# Altium project Cells_in_Space.PrjPcb (part 2 of 2)

## Sheet Valve.SchDoc
size A4; SheetNumber: 6; SheetTotal: 7
Used 16 times, as channels Designator/Valve1, Designator/Valve2, Designator/Valve3, Designator/Valve4, Designator/Valve5, Designator/Valve6, Designator/Valve7, Designator/Valve8, Designator/Valve9, Designator/Valve10, Designator/Valve11, Designator/Valve12, Designator/Valve13, Designator/Valve14, Designator/Valve15, Designator/Valve16. Parts and nets are listed once, with the designators drawn on the sheet.
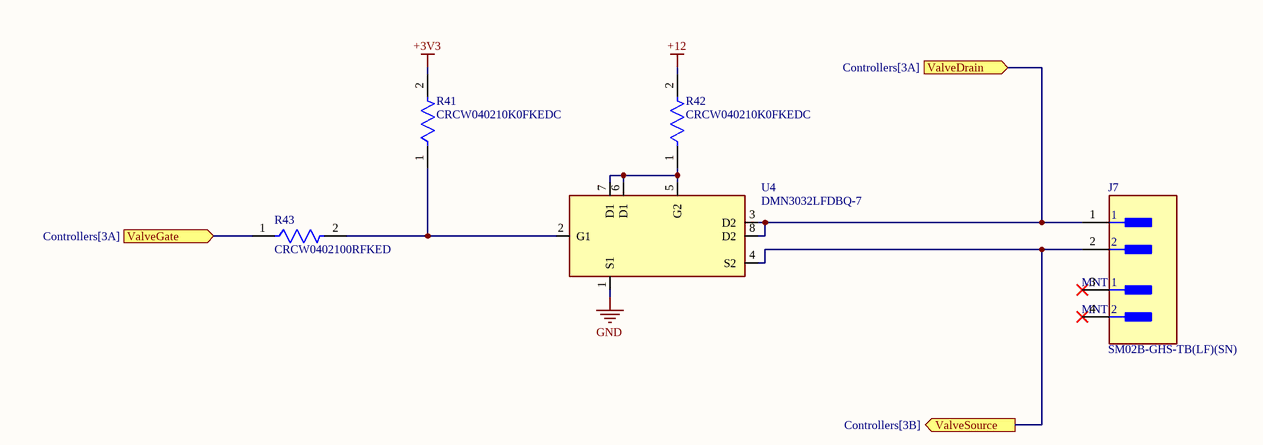
[diagram p6: Valve.SchDoc]

### Parts
J7  SM02B-GHS-TB(LF)(SN)  [FP-SM02B-GHS-TB_LF_SN-MFG]
R41  CRCW040210K0FKEDC  [FP-CRCW0402-C-e3-IPC_C]
R42  CRCW040210K0FKEDC  [FP-CRCW0402-C-e3-IPC_C]
R43  CRCW0402100RFKED  [FP-CRCW0402-e3-IPC_C]
U4  DMN3032LFDBQ-7  [DMN3032LFDBQ-13]

### Ports
ValveDrain (in, see Controllers[3A]), ValveGate (in, see Controllers[3A]), ValveSource (out, see Controllers[3B])

### Nets
+3V3: R41.2
+12: R42.2
GND: U4.1(S1)
ValveDrain: J7.1 U4.3(D2) U4.8(D2) ; port ValveDrain
ValveGate: R43.1 ; port ValveGate
ValveSource: J7.2 U4.4(S2) ; port ValveSource
NetR41_1: R41.1 R43.2 U4.2(G1)
NetR42_1: R42.1 U4.5(G2) U4.6(D1) U4.7(D1)

Not connected (* = marked no-connect by the designer): J7 3(MNT_1)* 4(MNT_2)*

### Channels
Designator/Valve1: designators end in _Valve1; ports ValveDrain=Driver_Out+1 ValveGate=ValveGate1 ValveSource=ValveDrain2
Designator/Valve2: designators end in _Valve2; ports ValveDrain=ValveDrain2 ValveGate=ValveGate2 ValveSource=ValveDrain3
Designator/Valve3: designators end in _Valve3; ports ValveDrain=ValveDrain3 ValveGate=ValveGate3 ValveSource=ValveDrain4
Designator/Valve4: designators end in _Valve4; ports ValveDrain=ValveDrain4 ValveGate=ValveGate4 ValveSource=ValveDrain5
Designator/Valve5: designators end in _Valve5; ports ValveDrain=ValveDrain5 ValveGate=ValveGate5 ValveSource=ValveDrain6
Designator/Valve6: designators end in _Valve6; ports ValveDrain=ValveDrain6 ValveGate=ValveGate6 ValveSource=ValveDrain7
Designator/Valve7: designators end in _Valve7; ports ValveDrain=ValveDrain7 ValveGate=ValveGate7 ValveSource=ValveDrain8
Designator/Valve8: designators end in _Valve8; ports ValveDrain=ValveDrain8 ValveGate=ValveGate8 ValveSource=Driver_Out-1
Designator/Valve9: designators end in _Valve9; ports ValveDrain=Driver_Out+2 ValveGate=ValveGate9 ValveSource=ValveDrain10
Designator/Valve10: designators end in _Valve10; ports ValveDrain=ValveDrain10 ValveGate=ValveGate10 ValveSource=ValveDrain11
Designator/Valve11: designators end in _Valve11; ports ValveDrain=ValveDrain11 ValveGate=ValveGate11 ValveSource=ValveDrain12
Designator/Valve12: designators end in _Valve12; ports ValveDrain=ValveDrain12 ValveGate=ValveGate12 ValveSource=ValveDrain13
Designator/Valve13: designators end in _Valve13; ports ValveDrain=ValveDrain13 ValveGate=ValveGate13 ValveSource=ValveDrain14
Designator/Valve14: designators end in _Valve14; ports ValveDrain=ValveDrain14 ValveGate=ValveGate14 ValveSource=ValveDrain15
Designator/Valve15: designators end in _Valve15; ports ValveDrain=ValveDrain15 ValveGate=ValveGate15 ValveSource=ValveDrain16
Designator/Valve16: designators end in _Valve16; ports ValveDrain=ValveDrain16 ValveGate=ValveGate16 ValveSource=Driver_Out-2

### Library data of the parts
J7 = CMP-2000-07076-2: CONN HEADER SMD R/A 2POS 1.25MM; Voltage Rating: 50V; Number of Positions: 2; Pitch: 0.049inch; Current Rating: 1A; Connector Type: Outer Shroud Contact; Number of Rows: 1; Contact Material: Bronze; Termination: Solder; Color: Natural; Package Quantity: 2500; Mount: Surface Mount; Housing Color: Natural; Number of Contacts: 2; Packaging: Tape and Reel; Lead Free: Lead Free; Housing Material: Nylon; Orientation: Right Angle; Contact Type: Male Pin; Contact Plating: Tin; Series: GH; Fastening Type: Latch
R41 R42 = CMP-02407-012085-1: RES 10K OHM 1% 1/16W 0402; Temperature Coefficient: 100ppm/°C; Power Rating: 62.5mW; Resistance: 10kR; Lead Free: Lead Free; Max Operating Temperature: 155°C; RoHS Compliant: Yes; Mount: Surface Mount; Min Operating Temperature: -55°C; Termination: Wraparound; Length: 1mm; Resistor Type: Thick Film; Contact Plating: Tin; Tolerance: 1%; Case/Package: Molded
R43 = CMP-1011-00397-3: RES Thick Film, 100Ω, 1%, 0.063W, 100ppm/°C, 0402; Max Power Dissipation: 63mW; Voltage Rating: 50V; Resistance: 100R; Package Quantity: 10; Lead Free: Lead Free; Termination: SMD/SMT; Case Code (Metric): 1005; Number of Terminations: 2; Composition: Thick Film; Voltage Rating (DC): 50V; Min Operating Temperature: -55°C; Case/Package: 0402; Radiation Hardening: No; Max Operating Temperature: 155°C; Temperature Coefficient: 100ppm/°C; Military Standard: Not; Length: 1mm; Mount: Surface Mount; Power Rating: 63mW; Weight: 2.3E-05oz; Working Voltage: 50V; Features: Automotive AEC-Q200; Depth: 0.5mm; Packaging: Tape and Reel; Tolerance: 1%; Height: 0.35mm; Case Code (Imperial): 0402; Width: 0.02inch; Contact Plating: Tin
U4 = DMN3032LFDBQ: Value: *; Mouser URL: https://www.mouser.pl/ProductDetail/Diodes-Incorporated/DMN3032LFDBQ-13?qs=icAhCOE9Tbh4ep37eQESbg%3D%3D; MPN: *; Supplier: *; SupplierPartNumber: DMN3032LFDBQ-13

## Sheet Heater_conn.SchDoc
size A4; SheetNumber: 7; SheetTotal: 7
Used 2 times, as channels Heater_conn1, Heater_conn2. Parts and nets are listed once, with the designators drawn on the sheet.
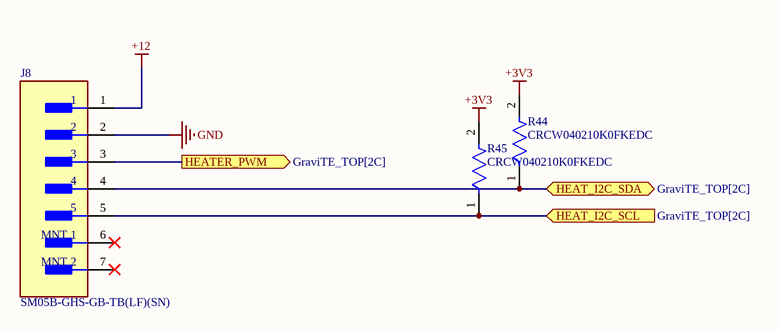
[diagram p7: Heater_conn.SchDoc]

### Parts
J8  SM05B-GHS-GB-TB(LF)(SN)  [FP-SM05B-GHS-GB-TB_LF_SN-MFG]
R44  CRCW040210K0FKEDC  [FP-CRCW0402-C-e3-IPC_C]
R45  CRCW040210K0FKEDC  [FP-CRCW0402-C-e3-IPC_C]

### Ports
HEAT_I2C_SCL (in, see GraviTE_TOP[2C]), HEAT_I2C_SDA (bidir, see GraviTE_TOP[2C]), HEATER_PWM (out, see GraviTE_TOP[2C])

### Nets
+3V3: R44.2 R45.2
+12: J8.1
GND: J8.2
HEAT_I2C_SCL: J8.5 R45.1 ; port HEAT_I2C_SCL
HEAT_I2C_SDA: J8.4 R44.1 ; port HEAT_I2C_SDA
HEATER_PWM: J8.3 ; port HEATER_PWM

Not connected (* = marked no-connect by the designer): J8 6(MNT_1)* 7(MNT_2)*

### Channels
Heater_conn1: designators end in _Heater_conn1; ports HEAT_I2C_SCL=HEAT_I2C_SCL1 HEAT_I2C_SDA=HEAT_I2C_SDA1 HEATER_PWM=HEATER_PWM1
Heater_conn2: designators end in _Heater_conn2; ports HEAT_I2C_SCL=HEAT_I2C_SCL2 HEAT_I2C_SDA=HEAT_I2C_SDA2 HEATER_PWM=HEATER_PWM2

### Library data of the parts
J8 = CMP-17439-000484-1: Connector Header Surface Mount, Right Angle 5 position 0.049" (1.25mm)
R44 R45 = CMP-02407-012085-1: as R41 on sheet Valve; Lead Free: Lead Free; Max Operating Temperature: 155°C; RoHS Compliant: Yes; Mount: Surface Mount; Min Operating Temperature: -55°C; Termination: Wraparound; Length: 1mm; Resistor Type: Thick Film; Contact Plating: Tin; Tolerance: 1%; Case/Package: Molded

## Nets that join several sheets
+3V3: PowerInput (C4.1 IC3.1 IC3.2 TP4.1), MCU (51 pins), Designator/CC_oct_driver1 (B2_CC_oct_driver1.6 C49_CC_oct_driver1.2 J5_CC_oct_driver1.2), Designator/CC_oct_driver2 (B2_CC_oct_driver2.6 C49_CC_oct_driver2.2 J5_CC_oct_driver2.2), Designator/Valve1 (R41_Valve1.2), Designator/Valve2 (R41_Valve2.2), Designator/Valve3 (R41_Valve3.2), Designator/Valve4 (R41_Valve4.2), Designator/Valve5 (R41_Valve5.2), Designator/Valve6 (R41_Valve6.2), Designator/Valve7 (R41_Valve7.2), Designator/Valve8 (R41_Valve8.2), Designator/Valve9 (R41_Valve9.2), Designator/Valve10 (R41_Valve10.2), Designator/Valve11 (R41_Valve11.2), Designator/Valve12 (R41_Valve12.2), Designator/Valve13 (R41_Valve13.2), Designator/Valve14 (R41_Valve14.2), Designator/Valve15 (R41_Valve15.2), Designator/Valve16 (R41_Valve16.2), Heater_conn1 (R44_Heater_conn1.2 R45_Heater_conn1.2), Heater_conn2 (R44_Heater_conn2.2 R45_Heater_conn2.2)
+5: PowerInput (10 pins), MCU (C9.1 C10.1 IC4.1)
+12: PowerInput (7 pins), Controllers (5 pins), Designator/CC_oct_driver1 (5 pins), Designator/CC_oct_driver2 (5 pins), Designator/Valve1 (R42_Valve1.2), Designator/Valve2 (R42_Valve2.2), Designator/Valve3 (R42_Valve3.2), Designator/Valve4 (R42_Valve4.2), Designator/Valve5 (R42_Valve5.2), Designator/Valve6 (R42_Valve6.2), Designator/Valve7 (R42_Valve7.2), Designator/Valve8 (R42_Valve8.2), Designator/Valve9 (R42_Valve9.2), Designator/Valve10 (R42_Valve10.2), Designator/Valve11 (R42_Valve11.2), Designator/Valve12 (R42_Valve12.2), Designator/Valve13 (R42_Valve13.2), Designator/Valve14 (R42_Valve14.2), Designator/Valve15 (R42_Valve15.2), Designator/Valve16 (R42_Valve16.2), Heater_conn1 (J8_Heater_conn1.1), Heater_conn2 (J8_Heater_conn2.1)
GND: PowerInput (26 pins), MCU (59 pins), Controllers (12 pins), Designator/CC_oct_driver1 (8 pins), Designator/CC_oct_driver2 (8 pins), Designator/Valve1 (U4_Valve1.1), Designator/Valve2 (U4_Valve2.1), Designator/Valve3 (U4_Valve3.1), Designator/Valve4 (U4_Valve4.1), Designator/Valve5 (U4_Valve5.1), Designator/Valve6 (U4_Valve6.1), Designator/Valve7 (U4_Valve7.1), Designator/Valve8 (U4_Valve8.1), Designator/Valve9 (U4_Valve9.1), Designator/Valve10 (U4_Valve10.1), Designator/Valve11 (U4_Valve11.1), Designator/Valve12 (U4_Valve12.1), Designator/Valve13 (U4_Valve13.1), Designator/Valve14 (U4_Valve14.1), Designator/Valve15 (U4_Valve15.1), Designator/Valve16 (U4_Valve16.1), Heater_conn1 (J8_Heater_conn1.2), Heater_conn2 (J8_Heater_conn2.2)
5V_current: PowerInput (R10.2), MCU (U1.29)
12V_current: PowerInput (R3.2), MCU (U1.28)
Driver_Out+1: Designator/CC_oct_driver1 (5 pins), Designator/Valve1 (J7_Valve1.1 U4_Valve1.3 U4_Valve1.8)
Driver_Out+2: Designator/CC_oct_driver2 (5 pins), Designator/Valve9 (J7_Valve9.1 U4_Valve9.3 U4_Valve9.8)
Driver_Out-1: Designator/CC_oct_driver1 (C50_CC_oct_driver1.2 L2_CC_oct_driver1.1), Designator/Valve8 (J7_Valve8.2 U4_Valve8.4)
Driver_Out-2: Designator/CC_oct_driver2 (C50_CC_oct_driver2.2 L2_CC_oct_driver2.1), Designator/Valve16 (J7_Valve16.2 U4_Valve16.4)
EN_PUMP1: MCU (U1.101), Controllers (B1.1)
EN_PUMP2: MCU (U1.102), Controllers (B1.3)
EN_PUMP_PWR: MCU (U1.103), Controllers (U3.9)
SCL: MCU (R14.2 U1.10), Designator/CC_oct_driver1 (B2_CC_oct_driver1.5), Designator/CC_oct_driver2 (B2_CC_oct_driver2.5)
SDA: MCU (R15.2 U1.11), Designator/CC_oct_driver1 (B2_CC_oct_driver1.4), Designator/CC_oct_driver2 (B2_CC_oct_driver2.4)
ValveDrain2: Designator/Valve1 (J7_Valve1.2 U4_Valve1.4), Designator/Valve2 (J7_Valve2.1 U4_Valve2.3 U4_Valve2.8)
ValveDrain3: Designator/Valve2 (J7_Valve2.2 U4_Valve2.4), Designator/Valve3 (J7_Valve3.1 U4_Valve3.3 U4_Valve3.8)
ValveDrain4: Designator/Valve3 (J7_Valve3.2 U4_Valve3.4), Designator/Valve4 (J7_Valve4.1 U4_Valve4.3 U4_Valve4.8)
ValveDrain5: Designator/Valve4 (J7_Valve4.2 U4_Valve4.4), Designator/Valve5 (J7_Valve5.1 U4_Valve5.3 U4_Valve5.8)
ValveDrain6: Designator/Valve5 (J7_Valve5.2 U4_Valve5.4), Designator/Valve6 (J7_Valve6.1 U4_Valve6.3 U4_Valve6.8)
ValveDrain7: Designator/Valve6 (J7_Valve6.2 U4_Valve6.4), Designator/Valve7 (J7_Valve7.1 U4_Valve7.3 U4_Valve7.8)
ValveDrain8: Designator/Valve7 (J7_Valve7.2 U4_Valve7.4), Designator/Valve8 (J7_Valve8.1 U4_Valve8.3 U4_Valve8.8)
ValveDrain10: Designator/Valve9 (J7_Valve9.2 U4_Valve9.4), Designator/Valve10 (J7_Valve10.1 U4_Valve10.3 U4_Valve10.8)
ValveDrain11: Designator/Valve10 (J7_Valve10.2 U4_Valve10.4), Designator/Valve11 (J7_Valve11.1 U4_Valve11.3 U4_Valve11.8)
ValveDrain12: Designator/Valve11 (J7_Valve11.2 U4_Valve11.4), Designator/Valve12 (J7_Valve12.1 U4_Valve12.3 U4_Valve12.8)
ValveDrain13: Designator/Valve12 (J7_Valve12.2 U4_Valve12.4), Designator/Valve13 (J7_Valve13.1 U4_Valve13.3 U4_Valve13.8)
ValveDrain14: Designator/Valve13 (J7_Valve13.2 U4_Valve13.4), Designator/Valve14 (J7_Valve14.1 U4_Valve14.3 U4_Valve14.8)
ValveDrain15: Designator/Valve14 (J7_Valve14.2 U4_Valve14.4), Designator/Valve15 (J7_Valve15.1 U4_Valve15.3 U4_Valve15.8)
ValveDrain16: Designator/Valve15 (J7_Valve15.2 U4_Valve15.4), Designator/Valve16 (J7_Valve16.1 U4_Valve16.3 U4_Valve16.8)